# EAGLE design SFXboard (EAGLE 6.2)
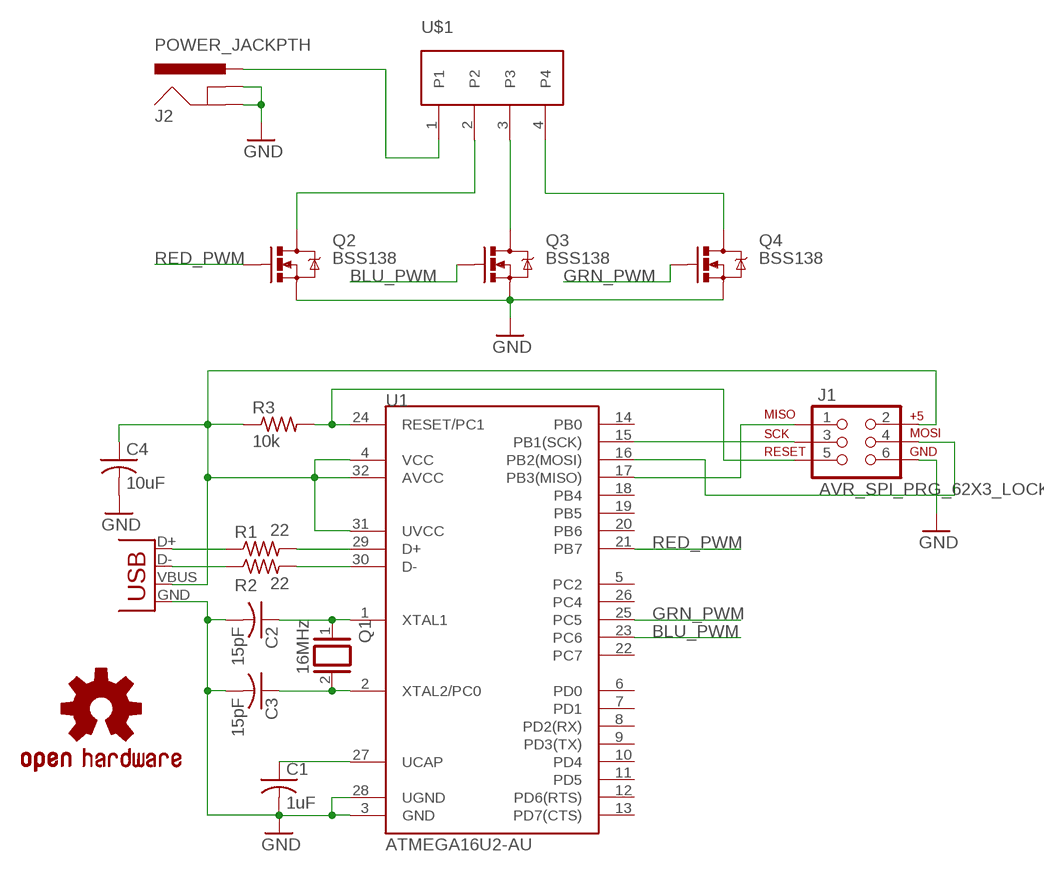
[diagram p0: schematic, sheet 1]

## Parts
C1  1uF  C-USC0805  [C0805]
C2  15pF  C-USC0805  [C0805]
C3  15pF  C-USC0805  [C0805]
C4  10uF  C-USC0805  [C0805]
J1  AVR_SPI_PRG_62X3_LOCK  [2X3_LOCK]
J2  POWER_JACKPTH  [POWER_JACK_PTH]
Q1  16MHz  XTAL/S  [QS]
Q2  BSS138  BSS138TRANS-00830  [SOT23-3]
Q3  BSS138  BSS138TRANS-00830  [SOT23-3]
Q4  BSS138  BSS138TRANS-00830  [SOT23-3]
R1  22  R-US_R0805  [R0805]
R2  22  R-US_R0805  [R0805]
R3  10k  R-US_R0805  [R0805]
U1  ATMEGA16U2-AU  ATMEGA8U2AU  [TQFP32-08]
U$1  TERMBLOCK4POS  [TERMBLOCK4P]
U$2  OSHW-LOGOS  [OSHW-LOGO-S]
X1  USBSMD  [USB-MINIB]

## Nets
BLU_PWM: Q3.1(G) U1.23(PC6)
GND: C1.2 C2.2 C3.2 C4.2 J1.6 J2.GND J2.GNDBREAK Q2.2(S) Q3.2(S) Q4.2(S) U1.3(GND) U1.28(UGND) X1.GND
GRN_PWM: Q4.1(G) U1.25(PC5)
N$1: C1.1 U1.27(UCAP)
N$2: C4.1 J1.2 R3.1 U1.4(VCC) U1.31(UVCC) U1.32(AVCC) X1.VBUS
N$3: R1.1 X1.D+
N$4: R2.1 X1.D-
N$5: R1.2 U1.29(D+)
N$6: R2.2 U1.30(D-)
N$7: J1.5 R3.2 U1.24(RESET/PC1)
N$8: C2.1 Q1.1 U1.1(XTAL1)
N$9: C3.1 Q1.2 U1.2(XTAL2/PC0)
N$10: Q2.3(D) U$1.2
N$11: J1.3 U1.15(PB1(SCK))
N$12: J1.1 U1.17(PB3(MISO))
N$13: J1.4 U1.16(PB2(MOSI))
N$14: Q3.3(D) U$1.3
N$15: Q4.3(D) U$1.4
N$16: J2.PWR U$1.1
RED_PWM: Q2.1(G) U1.21(PB7)
Unconnected: U1.5(PC2) U1.6(PD0) U1.7(PD1) U1.8(PD2(RX)) U1.9(PD3(TX)) U1.10(PD4) U1.11(PD5) U1.12(PD6(RTS)) U1.13(PD7(CTS)) U1.14(PB0) U1.18(PB4) U1.19(PB5) U1.20(PB6) U1.22(PC7) U1.26(PC4)

## Library data of the parts
C1-C4 = resistor:C-US: CAPACITOR, American symbol
J1 = SparkFun-Connectors:AVR_SPI_PRG_6: AVR ISP 6 Pin This is the reduced ISP connector for AVR programming. Common on Arduino. This footprint will take up less PCB space and can be used with a 10-pin to 6-pin adapter such as SKU: BOB-08508
J2 = SparkFun-Connectors:POWER_JACK: Power Jack This is the standard 5.5mm barrel jack for power. The PTH is the most common, proven, reliable, footprint. All others are experimental. The Slot footprint only works if the mill layer is transmitted to the PCB fab house so be warned. Spark Fun Electronics SKU : PRT-00119. Mating wall wart : TOL-00298 (and others)
Q1 = special:XTAL/S: CRYSTAL
Q2-Q4 = SparkFun-DiscreteSemi:BSS138: NMOSFET, Enh Mode 50V/6-ohm 200mA (SOT-23) TRANS-00830; PROD_ID: TRANS-00830
R1-R3 = resistor:R-US_: RESISTOR, American symbol
U1 = SparkFun-DigitalIC:ATMEGA8U2: Atmel 32-pin 8-bit Microcontroller with 8/16/32K Bystes of ISP Flash and USB Controller. ATmega8U2, ATmega16U2, and ATmega32U2
U$1 = sfxboard:TERMBLOCK4POS: 4 pin terminal block, 5.08mm spacing
U$2 = SparkFun-Aesthetics:OSHW-LOGO: Open Source Hardware Logo This logo indicates the piece of hardware it is found on incorporates a OSHW license and/or adheres to the definition of open source hardware found here: http://freedomdefined.org/OSHW
X1 = SparkFun-Connectors:USB: USB Connectors USB-B-PTH is fully proven SKU : PRT-00139 USB-miniB is fully proven SKU : PRT-00587 USB-A-PCB is untested. USB-A-H is throughly reviewed, but untested. Spark Fun Electronics SKU : PRT-00437 USB-B-SMT is throughly reviewed, but untested. Needs silkscreen touching up. USB-A-S has not been used/tested USB-MB-H has not been used/tested

## Board
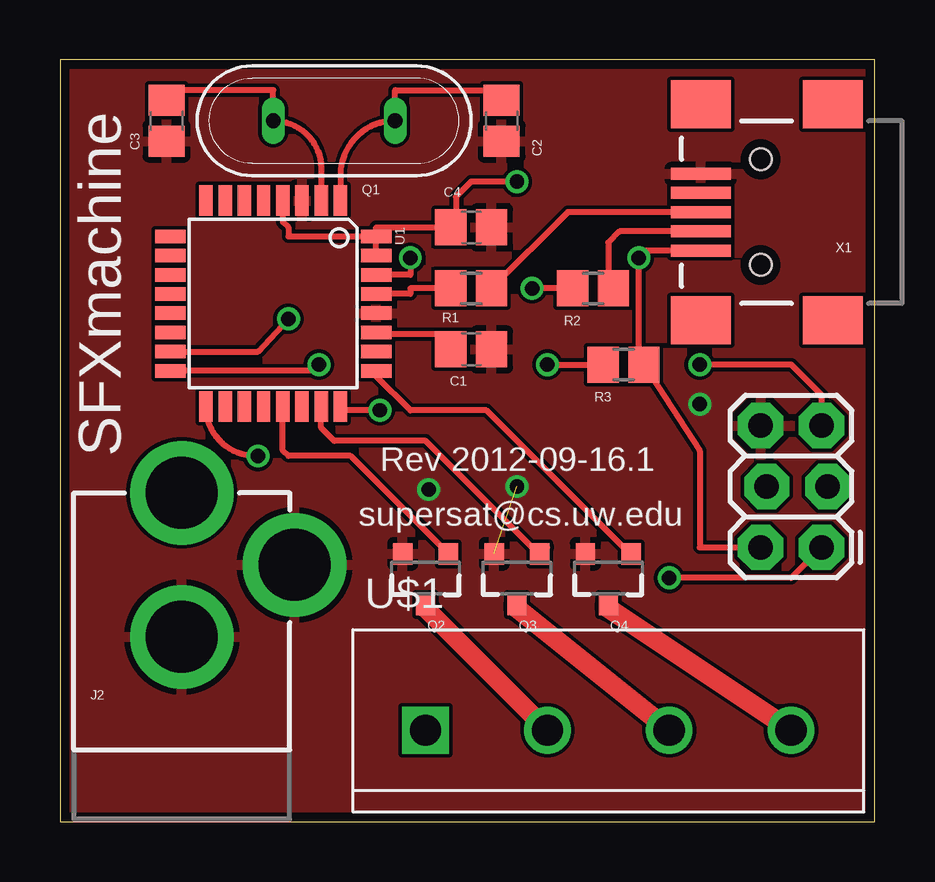
[diagram p1: board, top side]
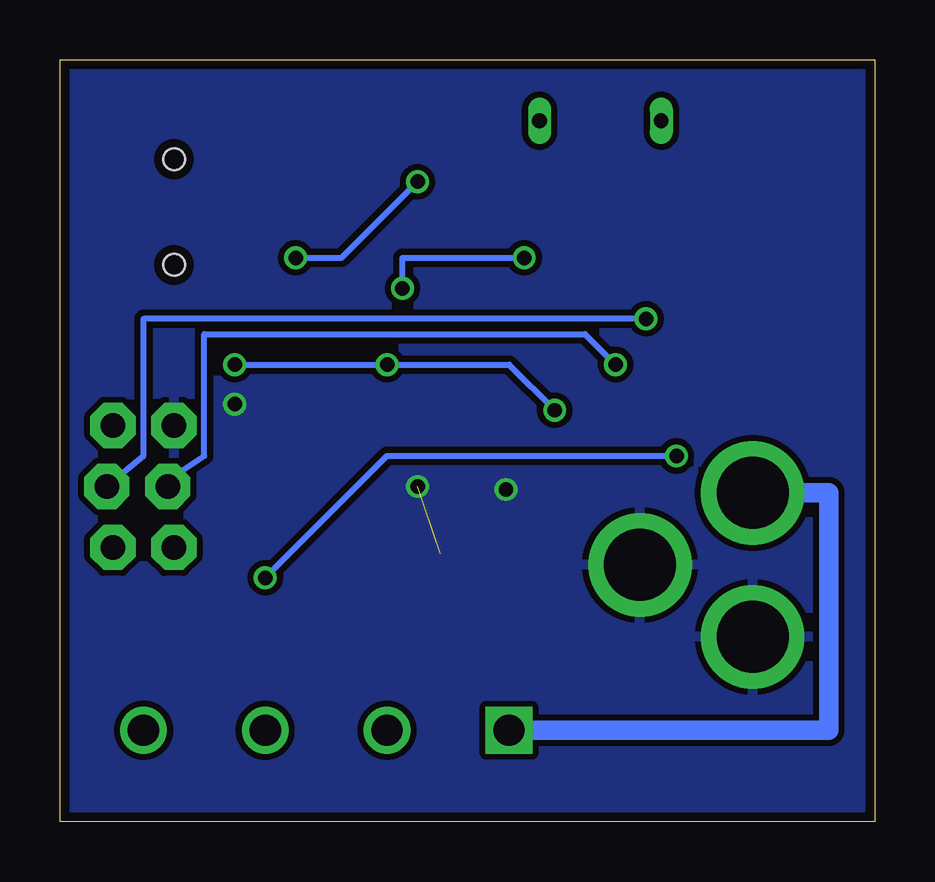
[diagram p2: board, bottom side, seen from below]

Size 33.96 x 31.74 mm. Coordinates in mm from the lower left corner, seen from the top.
Outline: 0,0 33.96,0 33.96,31.74 0,31.74 0,0
Copper layers (1*16): Top 0.0356mm / dielectric 1.5011mm / Bottom 0.0356mm
Design rules: minimum track width 6mil, minimum drill 13mil, track to track 6mil, track to pad 6mil, pad to pad 6mil, via to via 6mil, smd to smd 6mil, copper to edge 15mil, drill to drill 6mil, minimum pad ring 7mil, minimum via ring 7mil, stop-mask expansion 4mil, vias tented up to drill 0mil, thermal gap 10mil

### Footprints (pad centres in the part's own frame; a part is rotated, then mirrored left to right if it is on the bottom)
C0805 = smd 1.3 x 1.5: 1 -0.85,0; 2 0.85,0
2X3_LOCK = drill 1.016 pad 1.88 octagon: 1 0,0; 2 0,2.54; 3 2.54,-0.254; 4 2.54,2.286; 5 5.08,0; 6 5.08,2.54
POWER_JACK_PTH = drill 2.997 pad 4.318: GND 0,7.7; GNDBREAK 4.7,10.7; PWR 0,13.7
QS = drill 0.61 long: 1 -2.54,0; 2 2.54,0
SOT23-3 = smd 0.8 x 0.9: 1 -0.95,-1; 2 0.95,-1; 3 0,1.1
R0805 = smd 1.3 x 1.5: 1 -0.85,0; 2 0.85,0
TQFP32-08 = smd 1.27 x 0.559: 1 -4.293,2.8; 2 -4.293,2; 3 -4.293,1.2; 4 -4.293,0.4; 5 -4.293,-0.4; 6 -4.293,-1.2; 7 -4.293,-2; 8 -4.293,-2.8; 17 4.293,-2.8; 18 4.293,-2; 19 4.293,-1.2; 20 4.293,-0.4; 21 4.293,0.4; 22 4.293,1.2; 23 4.293,2; 24 4.293,2.8 | smd 0.559 x 1.27: 9 -2.8,-4.293; 10 -2,-4.293; 11 -1.2,-4.293; 12 -0.4,-4.293; 13 0.4,-4.293; 14 1.2,-4.293; 15 2,-4.293; 16 2.8,-4.293; 25 2.8,4.293; 26 2,4.293; 27 1.2,4.293; 28 0.4,4.293; 29 -0.4,4.293; 30 -1.2,4.293; 31 -2,4.293; 32 -2.8,4.293
TERMBLOCK4P = drill 1.3 square: 1 -7.62,0 | drill 1.3: 2 -2.54,0; 3 2.54,0; 4 7.62,0
USB-MINIB = smd 2.5 x 0.5: D+ 2.5,0; D- 2.5,0.8; GND 2.5,-1.6; ID 2.5,-0.8; VBUS 2.5,1.6 | smd 2.5 x 2: MTN1 -3,4.5; MTN2 2.5,4.5; MTN3 -3,-4.5; MTN4 2.5,-4.5 | hole 0.9: 0,2.2; 0,-2.2

### Placement (x,y rotation side)
C1  17.14,19.68 0 top
C2  18.41,29.21 270 top
C3  4.45,29.21 270 top
C4  17.14,24.77 0 top
J1  31.75,11.43 90 top
J2  5.08,0 0 top
Q1  11.43,29.21 180 top
Q2  15.24,10.16 180 top
Q3  19.05,10.16 180 top
Q4  22.86,10.16 180 top
R1  17.14,22.23 180 top
R2  22.23,22.23 180 top
R3  23.5,19.05 180 top
U1  8.89,21.59 270 top
U$1  22.86,3.81 0 top
U$2  -13.97,19.05 0 top  (outside the outline)
X1  29.21,25.4 180 top

### Tracks (layer width: path | path; a pad name or v marks a point on that pad's centre or on a via)
BLU_PWM
  Top 0.254: Q3.1 20.27,11.43 | 20.27,11.43 20.32,11.43 | 20.27,11.43 19.68,11.43 15.24,15.88 11.43,15.88 10.89,16.41 U1.23
GND  (via drill 0.6)  (1 unrouted)
  other vias: 26.67,17.4 15.37,13.84 19.05,13.97
  pour Bottom (isolate 0.254): 0,31.75 34.29,31.75 34.29,0 0,0
  pour Top: 0,31.75 34.29,31.75 34.29,0 0,0
GRN_PWM
  Top 0.254: Q4.1 23.54,11.43 23.5,11.43 17.78,17.14 14.61,17.14 13.18,18.57 U1.25
N$1
  Top 0.254: U1.27 12.7,20.32 16.51,20.32 C1.1
N$2  (via drill 0.6)
  Top 0.254: U1.31 U1.32 | U1.32 13.18,24.77 C4.1 16.51,24.98 16.51,26.04 17.14,26.67 v19.05,26.67 | X1.VBUS 24.43,23.8 v24.13,23.5 24.13,19.05 R3.1 26.67,15.46 26.67,11.43 J1.2 | U1.4 9.29,25 9.53,24.77 9.53,24.39 U1.32
  Bottom 0.254: v24.13,23.5 22.23,23.5 v19.05,26.67
N$3
  Top 0.254: X1.D+ 21.17,25.4 R1.1
N$4
  Top 0.254: 22.86,22.23 R2.1 22.86,22.44 22.86,24.13 23.33,24.6 X1.D-
N$5
  Top 0.254: R1.2 14.61,22.23 14.61,21.99 U1.29
N$6  (via drill 0.6)
  Top 0.254: 12.7,22.86 U1.30 14.61,22.79 v14.61,23.5 | R2.2 v19.68,22.23
  Bottom 0.254: v19.68,22.23 19.68,23.5 v14.61,23.5
N$7  (via drill 0.6)
  Top 0.254: J1.5 31.75,17.78 30.48,19.05 v26.67,19.05 | v20.32,19.05 R3.2 | v13.34,17.14 11.84,17.14 U1.24
  Bottom 0.254: v26.67,19.05 v20.32,19.05 15.24,19.05 v13.34,17.14
N$8
  Top 0.254: C2.1 17.78,30.48 13.97,30.48 Q1.1 arc90 11.69,26.93 U1.1
N$9
  Top 0.254: C3.1 5.08,30.48 8.89,30.48 Q1.2 arc-90 10.89,27.21 U1.2
N$10
  Top 0.813: Q2.3 15.24,8.89 U$1.2
N$11  (via drill 0.6)
  Top 0.254: U1.15 8.26,19.59 v9.53,20.95
  Bottom 0.254: v9.53,20.95 30.48,20.95 30.48,15.24 J1.3
N$12  (via drill 0.6)
  Top 0.254: J1.1 30.48,10.16 v25.4,10.16 | v8.26,15.24 8.15,15.24 arc-90 U1.17
  Bottom 0.254: v25.4,10.16 20.32,15.24 v8.26,15.24
N$13  (via drill 0.6)
  Top 0.254: v10.79,19.05 10.54,18.79 U1.16
  Bottom 0.254: J1.4 29.46,14.22 27.94,15.24 27.94,20.32 12.06,20.32 v10.79,19.05
N$14
  Top 0.813: Q3.3 19.05,8.89 U$1.3
N$15
  Top 0.813: Q4.3 22.86,8.89 U$1.4
N$16
  Bottom 0.813: U$1.1 1.91,3.81 1.91,13.7 J2.PWR
RED_PWM
  Top 0.254: Q2.1 12.11,15.24 9.53,15.24 9.29,15.47 U1.21

### Text on the board
tPlace: SFXmachine | Rev 2012-09-16.1 | supersat@cs.uw.edu